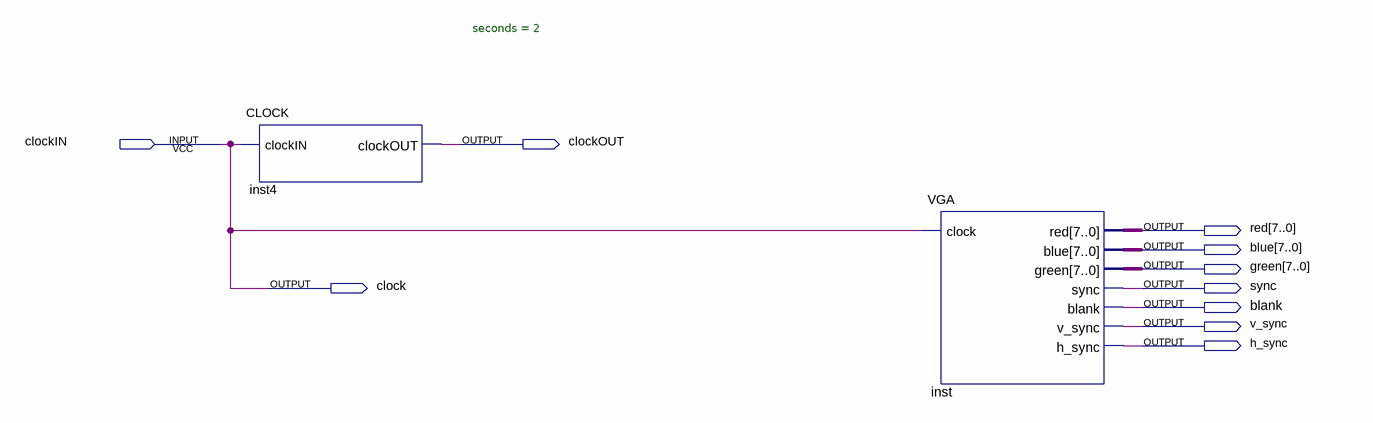
[diagram p0: schematic sheet]
// Quartus schematic ClockTest.bdf as structural Verilog: 2 symbols, 10 pins
module ClockTest (
  input  clockIN,
  output clockOUT,
  output [7:0] red,
  output [7:0] blue,
  output [7:0] green,
  output clock,
  output sync,
  output blank,
  output v_sync,
  output h_sync
);

  CLOCK #(.seconds(2)) inst4 (.clockIN(clockIN), .clockOUT(clockOUT));
  VGA inst (
    .clock(clockIN), .red(red), .blue(blue), .green(green), .sync(sync), .blank(blank), .v_sync(v_sync),
    .h_sync(h_sync));

  assign clock = clockIN;
endmodule
